# EAGLE board electrosteel2020_2 (EAGLE 9.2.2), part 1 of 3
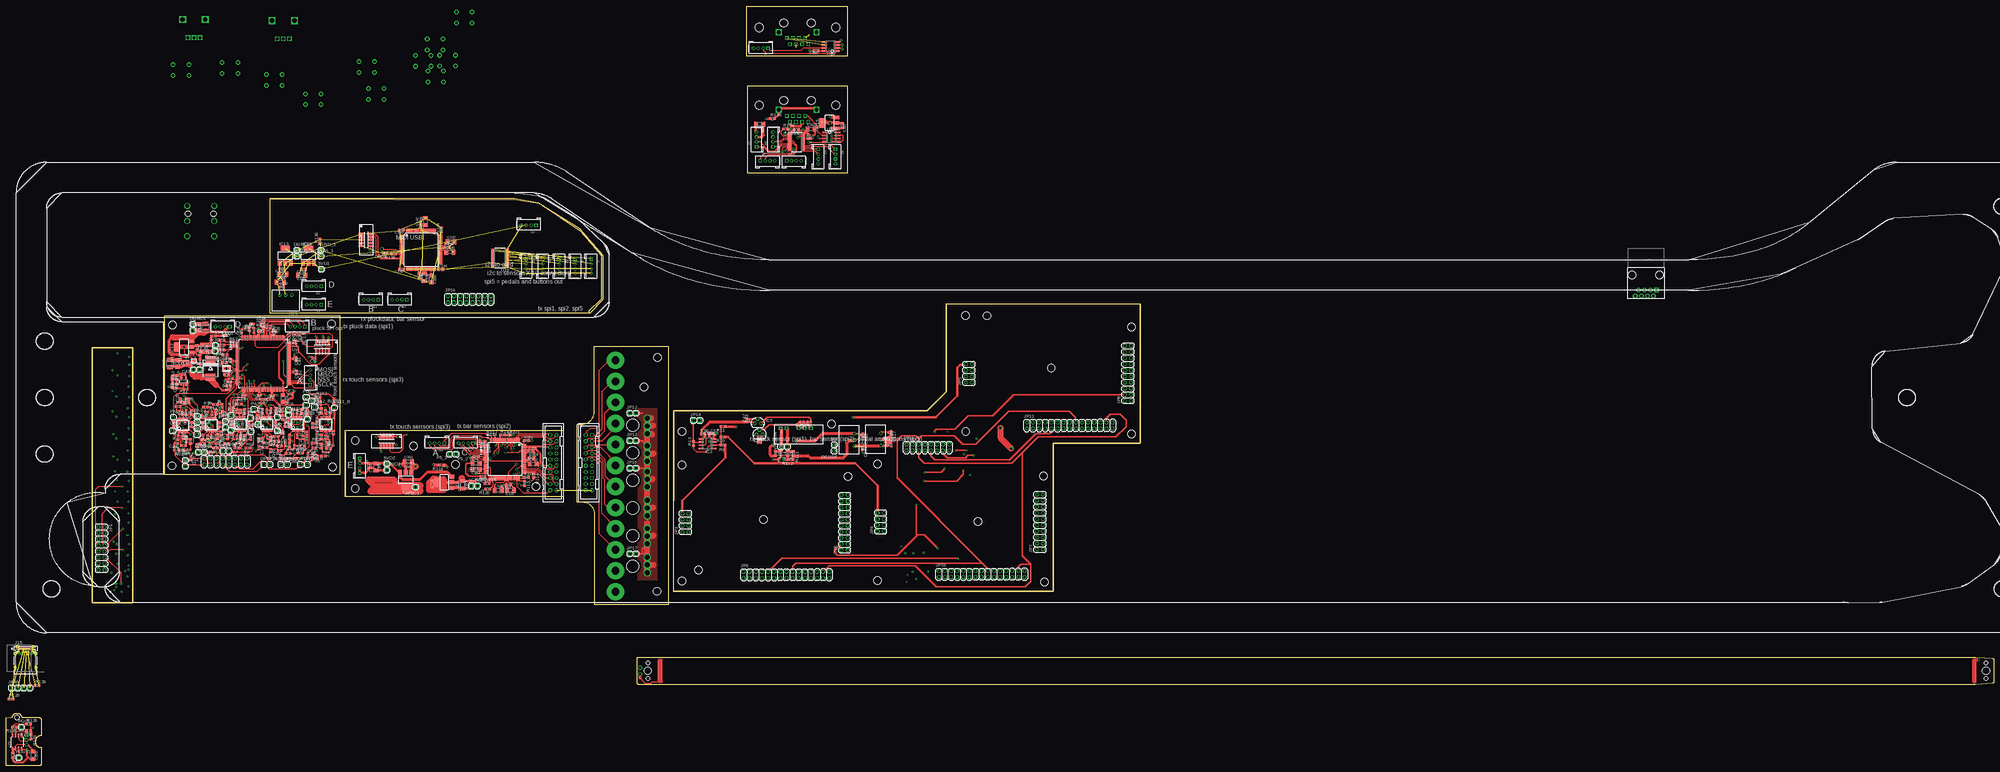
[diagram p7: board, top side]
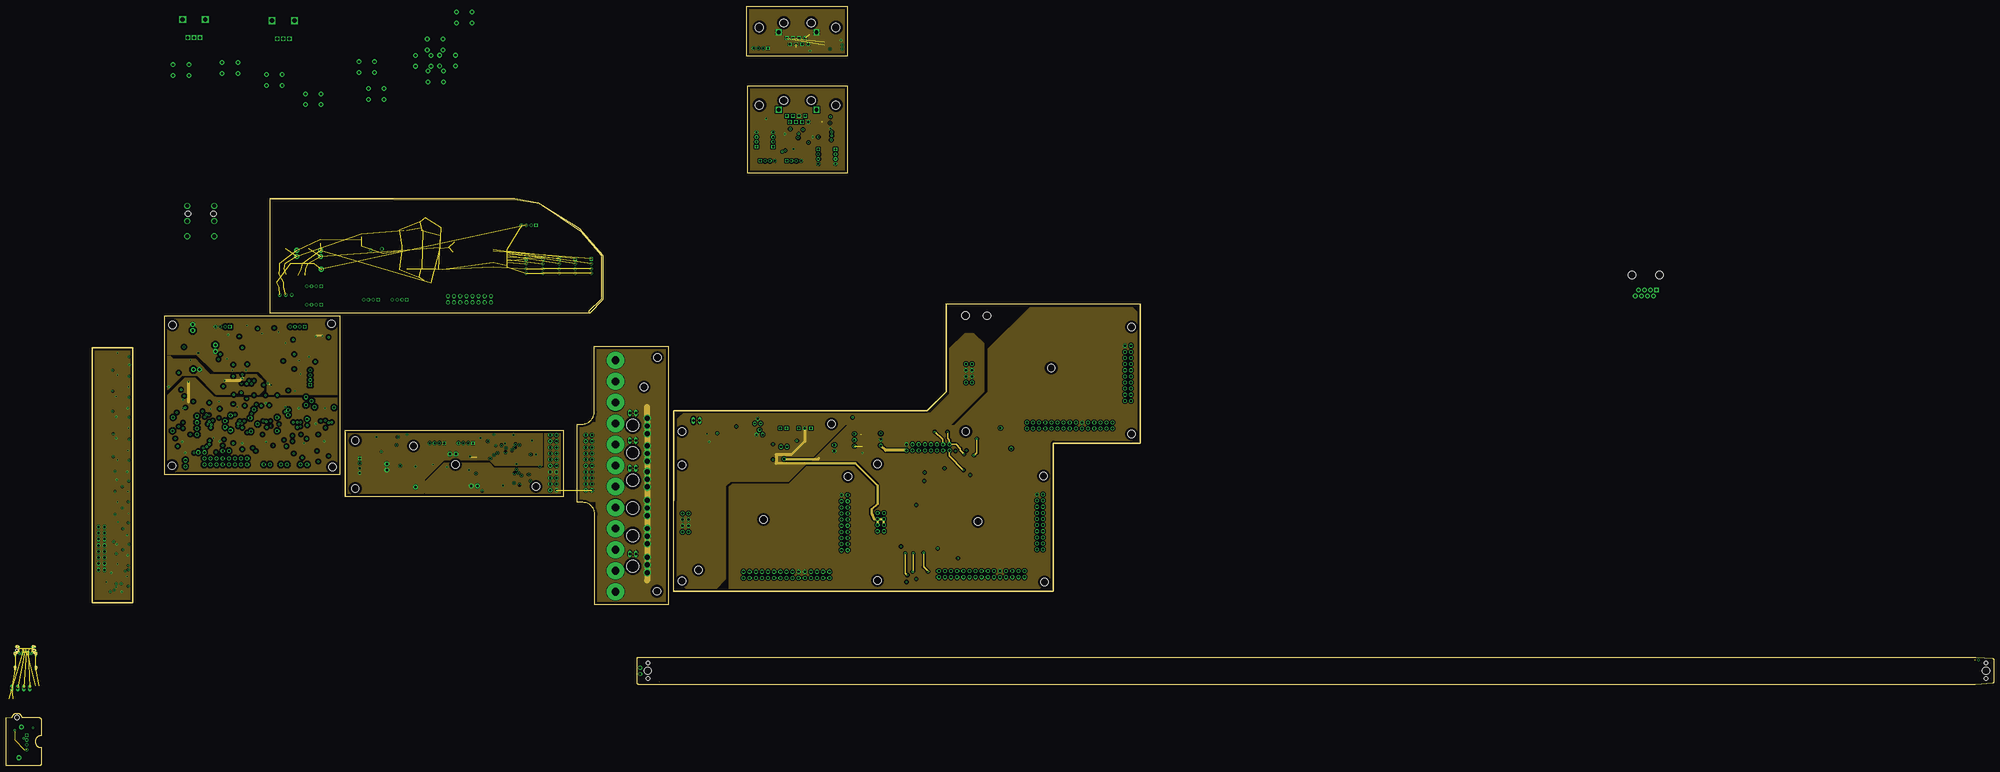
[diagram p8: board, inner layer Route2]
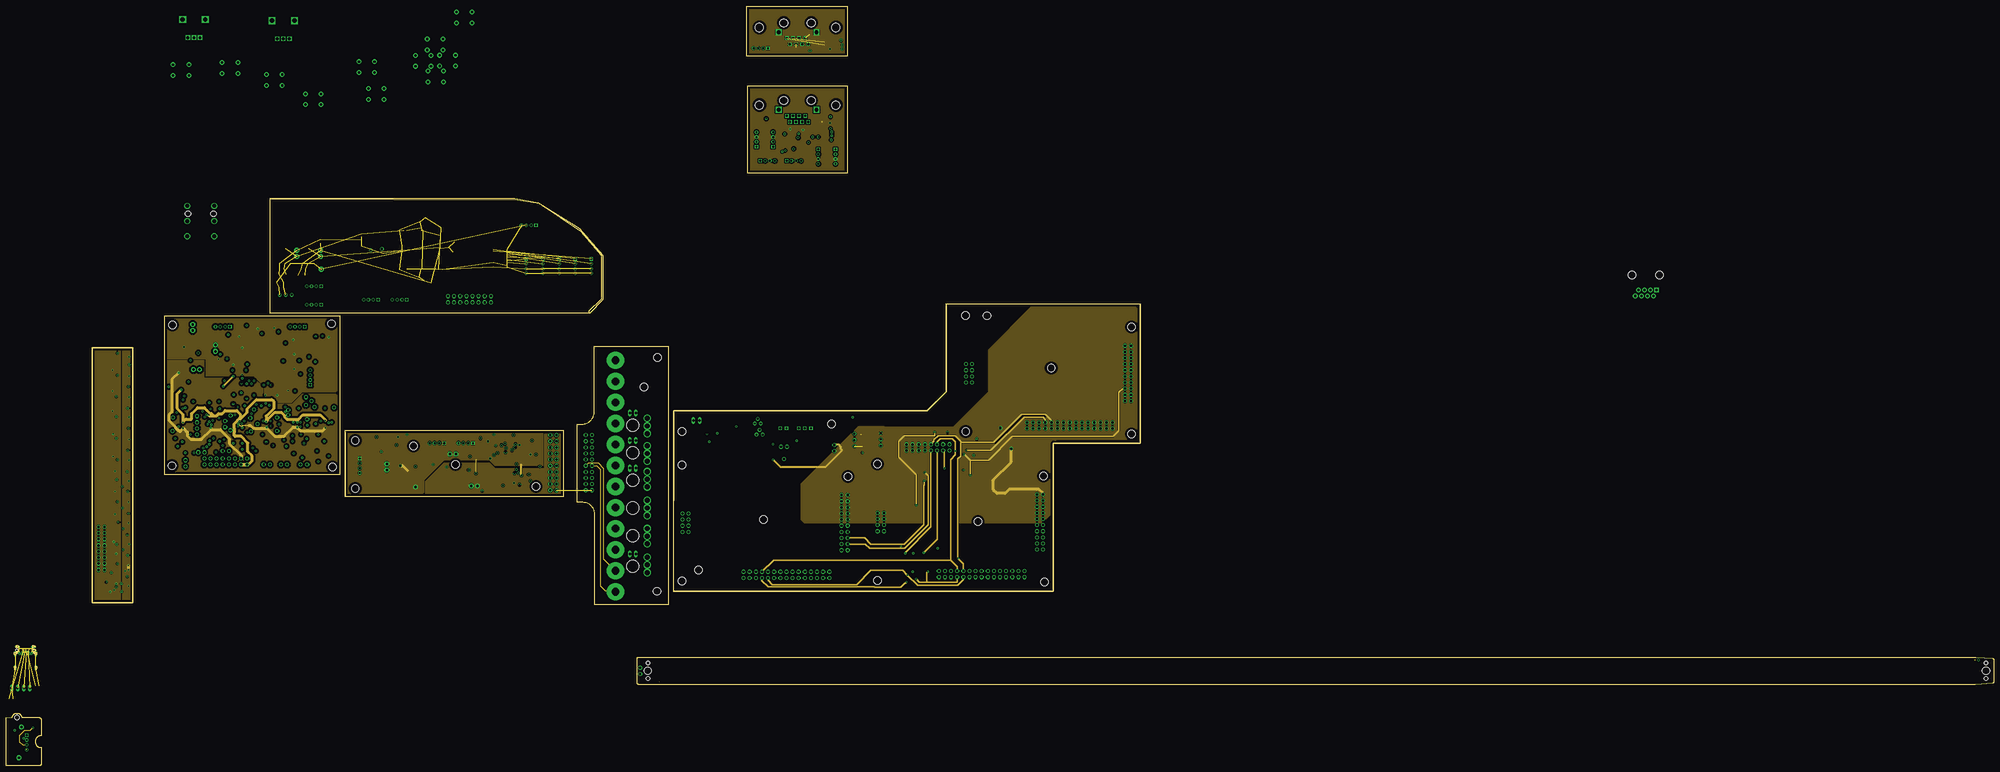
[diagram p9: board, inner layer Route15]
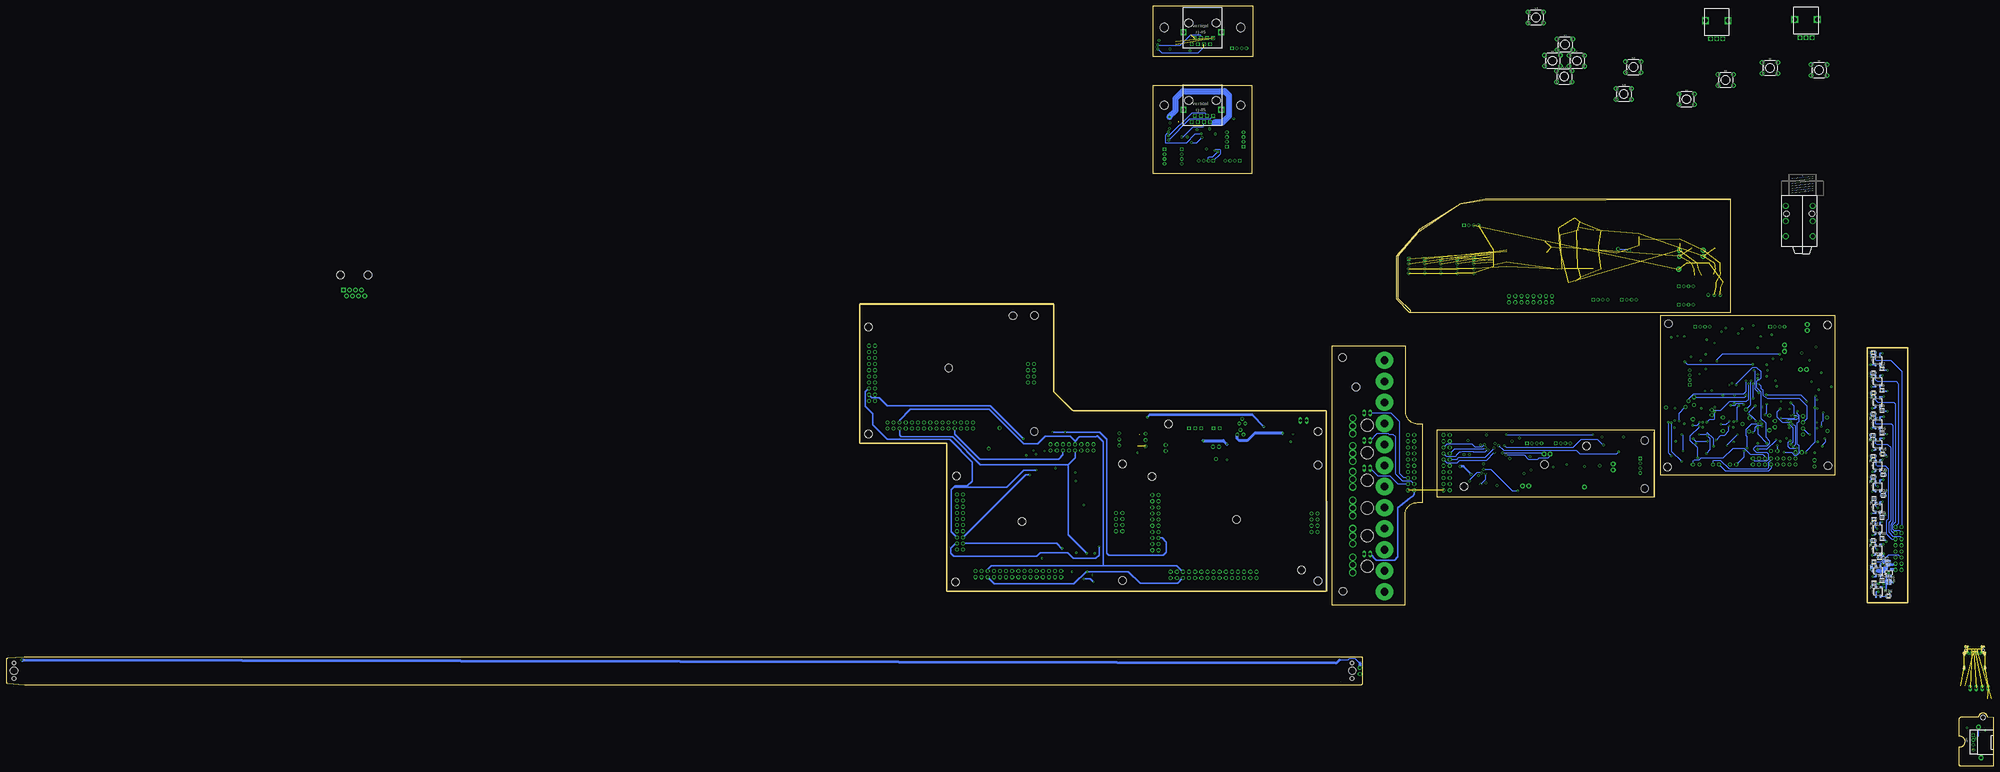
[diagram p10: board, bottom side, seen from below]

Size 824.87 x 315.26 mm. Coordinates in mm from the lower left corner, seen from the top.
Outline: 277.11,147.37 276.86,72.44 434.59,72.44 434.59,133.91 470.66,133.91 470.66,191.57 390.14,191.57 390.14,155.24 382.02,147.37 277.11,147.37
Outline: 109.47,235.25 109.47,188.01 242.32,188.01 247.9,193.6 247.9,211.63 238,222.81 220.98,233.48 211.07,235.25 109.47,235.25
Outline: 35.81,173.53 52.58,173.53 52.58,67.61 35.81,67.61 35.81,173.53
Outline: 244.09,174.04 274.83,174.04 274.83,66.85 244.35,66.85 244.35,104.19 arc90 239.27,109.27 236.98,109.27 236.98,141.78 239.01,141.78 arc90 244.09,146.86 244.09,174.04
Outline: 231.14,139.24 231.14,111.56 140.72,111.56 140.72,139.24 231.14,139.24
Outline: 824.28,34.29 817.14,33.71 arc-5 817.09,33.71 262.51,33.71 arc-90 261.87,34.34 261.87,44.5 arc-90 262.51,45.14 817.22,45.14 arc-5 817.27,45.13 824.28,44.55 arc-85 824.87,43.92 824.87,34.93 arc-85 824.28,34.29
Outline: 65.79,186.74 138.43,186.74 138.43,120.7 65.79,120.7 65.79,186.74
Outline: 2.64,20.07 arc-90 4.45,21.84 4.67,21.84 arc-90 6.48,20.07 13.69,20.07 arc-90 14.58,19.2 14.58,12.57 arc-90 14.45,12.45 arc95 12.17,9.93 arc90 14.48,7.62 arc-90 14.58,7.52 14.58,0.79 arc-90 13.79,0 0,0 0.03,20.04 2.64,20.07
Outline: 307.85,282.24 349,282.24 349,245.92 307.85,245.92 307.85,282.24
Outline: 307.34,315.26 349,315.26 349,294.44 307.34,294.44 307.34,315.26
Copper layers (1+2*15+16): Top 0.035mm / dielectric 0.5mm / Route2 0.035mm / dielectric 0.5mm / Route15 0.035mm / dielectric 0.5mm / Bottom 0.035mm
Design rules "default *": minimum track width 6mil, minimum drill 0.35mm, track to track 9mil, track to pad 9mil, pad to pad 9mil, via to via 9mil, smd to smd 9mil, copper to edge 40mil, drill to drill 6mil, minimum pad ring 10mil, minimum via ring 8mil, stop-mask expansion 4mil, vias tented up to drill 0mil, thermal gap 10mil
Holes 3.17 mm at 280.54,124.89 349.38,120.07 280.54,76.76 361.57,125.15 430.4,120.32 361.62,76.99 398.15,186.89 466.95,182.07 398.22,138.71 270.13,72.44 144.91,134.92 264.8,157.28 68.83,124.51 69.09,182.93 135.13,183.44 135.38,124 314.32,102.16 403.23,101.4 433.71,165.15 342.52,141.78 280.54,138.73 466.98,137.72 407.04,186.74 287.4,81.33 430.91,76.25 270.38,169.47 186.56,125.02 219.84,115.87 169.04,132.64 144.91,115.11
Holes 3.05 mm at 266.32,39.42 821.56,39.42
Holes 1.52 mm at 266.32,36.25 266.32,42.6 821.56,36.25 821.56,42.6
Holes 5.08 mm at 260.1,141.27 260.1,129.84 260.1,118.41 260.1,106.98 260.1,95.55 260.1,82.85
Holes 2.03 mm at 4.55,20.02
Holes 3.56 mm at 312.55,274.12 344.3,274.12 312.55,306.37 344.3,306.37
Milling: 41 lines

## Footprints (pad centres in the part's own frame; a part is rotated, then mirrored left to right if it is on the bottom)
1X01 = drill 1.016 pad 1.93 octagon: 1 0,0
1X01' = drill 1.016 octagon: 1 0,0
C0402 = smd 0.7 x 0.9: 1 -0.65,0; 2 0.65,0
C0201 = smd 0.25 x 0.35: 1 -0.25,0; 2 0.25,0
C0603 = smd 1.1 x 1: 1 -0.85,0; 2 0.85,0
C1206 = smd 1.6 x 1.8: 1 -1.4,0; 2 1.4,0
SMC_B = smd 1.6 x 2.4: + -1.5,0; - 1.5,0
C0603K = smd 1.05 x 1.08: 1 -0.875,0; 2 0.875,0
C1206K = smd 1.5 x 2: 1 -1.5,0; 2 1.5,0
SMC = smd 2.8 x 3.8: A 3.7,0; C -3.7,0
TSSOP14 = smd 0.305 x 0.991: 1 -1.905,-2.718; 2 -1.27,-2.718; 3 -0.635,-2.718; 4 0,-2.718; 5 0.635,-2.718; 6 1.27,-2.718; 7 1.905,-2.718; 8 1.905,2.718; 9 1.27,2.718; 10 0.635,2.718; 11 0,2.718; 12 -0.635,2.718; 13 -1.27,2.718; 14 -1.905,2.718
SO08 = smd 0.6 x 2.2: 1 -1.905,-2.6; 2 -0.635,-2.6; 3 0.635,-2.6; 4 1.905,-2.6; 5 1.905,2.6; 6 0.635,2.6; 7 -0.635,2.6; 8 -1.905,2.6
QFP50P2200X2200X160-144N = smd 1.56 x 0.28: 1 -10.68,8.75; 2 -10.68,8.25; 3 -10.68,7.75; 4 -10.68,7.25; 5 -10.68,6.75; 6 -10.68,6.25; 7 -10.68,5.75; 8 -10.68,5.25; 9 -10.68,4.75; 10 -10.68,4.25; 11 -10.68,3.75; 12 -10.68,3.25; 13 -10.68,2.75; 14 -10.68,2.25; 15 -10.68,1.75; 16 -10.68,1.25; 17 -10.68,0.75; 18 -10.68,0.25; 19 -10.68,-0.25; 20 -10.68,-0.75; 21 -10.68,-1.25; 22 -10.68,-1.75; 23 -10.68,-2.25; 24 -10.68,-2.75; 25 -10.68,-3.25; 26 -10.68,-3.75; 27 -10.68,-4.25; 28 -10.68,-4.75; 29 -10.68,-5.25; 30 -10.68,-5.75; 31 -10.68,-6.25; 32 -10.68,-6.75; 33 -10.68,-7.25; 34 -10.68,-7.75; 35 -10.68,-8.25; 36 -10.68,-8.75; 73 10.68,-8.75; 74 10.68,-8.25; 75 10.68,-7.75; 76 10.68,-7.25; 77 10.68,-6.75; 78 10.68,-6.25; 79 10.68,-5.75; 80 10.68,-5.25; 81 10.68,-4.75; 82 10.68,-4.25; 83 10.68,-3.75; 84 10.68,-3.25; 85 10.68,-2.75; 86 10.68,-2.25; 87 10.68,-1.75; 88 10.68,-1.25; 89 10.68,-0.75; 90 10.68,-0.25; 91 10.68,0.25; 92 10.68,0.75; 93 10.68,1.25; 94 10.68,1.75; 95 10.68,2.25; 96 10.68,2.75; 97 10.68,3.25; 98 10.68,3.75; 99 10.68,4.25; 100 10.68,4.75; 101 10.68,5.25; 102 10.68,5.75; 103 10.68,6.25; 104 10.68,6.75; 105 10.68,7.25; 106 10.68,7.75; 107 10.68,8.25; 108 10.68,8.75 | smd 0.28 x 1.56: 37 -8.75,-10.68; 38 -8.25,-10.68; 39 -7.75,-10.68; 40 -7.25,-10.68; 41 -6.75,-10.68; 42 -6.25,-10.68; 43 -5.75,-10.68; 44 -5.25,-10.68; 45 -4.75,-10.68; 46 -4.25,-10.68; 47 -3.75,-10.68; 48 -3.25,-10.68; 49 -2.75,-10.68; 50 -2.25,-10.68; 51 -1.75,-10.68; 52 -1.25,-10.68; 53 -0.75,-10.68; 54 -0.25,-10.68; 55 0.25,-10.68; 56 0.75,-10.68; 57 1.25,-10.68; 58 1.75,-10.68; 59 2.25,-10.68; 60 2.75,-10.68; 61 3.25,-10.68; 62 3.75,-10.68; 63 4.25,-10.68; 64 4.75,-10.68; 65 5.25,-10.68; 66 5.75,-10.68; 67 6.25,-10.68; 68 6.75,-10.68; 69 7.25,-10.68; 70 7.75,-10.68; 71 8.25,-10.68; 72 8.75,-10.68; 109 8.75,10.68; 110 8.25,10.68; 111 7.75,10.68; 112 7.25,10.68; 113 6.75,10.68; 114 6.25,10.68; 115 5.75,10.68; 116 5.25,10.68; 117 4.75,10.68; 118 4.25,10.68; 119 3.75,10.68; 120 3.25,10.68; 121 2.75,10.68; 122 2.25,10.68; 123 1.75,10.68; 124 1.25,10.68; 125 0.75,10.68; 126 0.25,10.68; 127 -0.25,10.68; 128 -0.75,10.68; 129 -1.25,10.68; 130 -1.75,10.68; 131 -2.25,10.68; 132 -2.75,10.68; 133 -3.25,10.68; 134 -3.75,10.68; 135 -4.25,10.68; 136 -4.75,10.68; 137 -5.25,10.68; 138 -5.75,10.68; 139 -6.25,10.68; 140 -6.75,10.68; 141 -7.25,10.68; 142 -7.75,10.68; 143 -8.25,10.68; 144 -8.75,10.68
SOT23-5 = smd 0.6 x 1.2: 1 -0.95,-1.306; 2 0,-1.306; 3 0.95,-1.306; 4 0.95,1.306; 5 -0.95,1.306
78LXX = drill 0.813 octagon: GND 0,1.905; IN 1.27,0; OUT -1.27,0
79LXX = drill 0.813 octagon: GND -1.27,0; IN 0,1.905; OUT 1.27,0
6-WSON = smd 0.45 x 0.3: 1 -0.975,0.65; 2 -0.975,0; 3 -0.975,-0.65; 4 0.975,-0.65; 5 0.975,0; 6 0.975,0.65 | smd 0.9 x 1.6: PAD 0,0
SOT223 = smd 1.499 x 2.007: 1 -2.261,-3.15; 2 0.025,-3.15; 3 2.311,-3.15 | smd 3.81 x 2.007: PAD 0,3.15
AUDIO_JACK_0.25"_TRS_PTH_RA = drill 1.6: RING 10.5,-6.95; RING-NORM 10.5,4.35; SLEEVE 4.2,-6.95; SLEEVE-NORM 4.2,4.35; TIP 16.8,-6.95; TIP-NORM 16.8,4.35 | hole 2.2: 7.4,4; 7.4,-6.6
HW4-2.0 = drill 0.8 pad 1.27 square: 1 -3,0 | drill 0.8 pad 1.27: 2 -1,0; 3 1,0; 4 3,0
RJ45-8 = drill 1 pad 1.88 square: 1 -4.445,6.35 | drill 1 pad 1.88: 2 -3.175,8.89; 3 -1.905,6.35; 4 -0.635,8.89; 5 0.635,6.35; 6 1.905,8.89; 7 3.175,6.35; 8 4.445,8.89 | hole 3.2: -5.715,0; 5.715,0
CUI_UJ31-CH-312-SMT-TR = smd 0.32 x 0.7: A1 0,0; A2 0.5,0; A3 1,0; A4 1.5,0; A5 2,0; A6 2.5,0; A7 3,0; A8 3.5,0; A9 4,0; A10 4.5,0; A11 5,0; A12 5.5,0 | drill 0.4 pad 0.6: B1 5.55,-1.31; B2 5.15,-2.01; B3 4.35,-2.01; B4 3.95,-1.31; B5 3.55,-2.01; B6 3.15,-1.31; B7 2.35,-1.31; B8 1.95,-2.01; B9 1.55,-1.31; B10 1.15,-2.01; B11 0.35,-2.01; B12 -0.05,-1.31 | drill 0.6 pad 0.7 long: SH1 -0.62,0.89; SH2 6.12,0.89 | drill 0.6 pad 0.8 long: SH3 -1.255,-1.66; SH4 6.755,-1.66 | drill 0.6 pad 0.9 long: SH5 -1.58,-2.16; SH6 7.08,-2.16; SH7 -1.58,-7.86; SH8 7.08,-7.86 | hole 0.85: -0.85,-0.66; 6.35,-0.66
HW4-2.0-90D = drill 0.8 pad 1.27 square: 1 -3,0 | drill 0.8 pad 1.27: 2 -1,0; 3 1,0; 4 3,0
2X08 = drill 1.016 octagon: 1 -8.89,-1.27; 2 -8.89,1.27; 3 -6.35,-1.27; 4 -6.35,1.27; 5 -3.81,-1.27; 6 -3.81,1.27; 7 -1.27,-1.27; 8 -1.27,1.27; 9 1.27,-1.27; 10 1.27,1.27; 11 3.81,-1.27; 12 3.81,1.27; 13 6.35,-1.27; 14 6.35,1.27; 15 8.89,-1.27; 16 8.89,1.27
2X04 = drill 1.016 octagon: 1 -3.81,-1.27; 2 -3.81,1.27; 3 -1.27,-1.27; 4 -1.27,1.27; 5 1.27,-1.27; 6 1.27,1.27; 7 3.81,-1.27; 8 3.81,1.27
2X10 = drill 1.016 octagon: 1 -11.43,-1.27; 2 -11.43,1.27; 3 -8.89,-1.27; 4 -8.89,1.27; 5 -6.35,-1.27; 6 -6.35,1.27; 7 -3.81,-1.27; 8 -3.81,1.27; 9 -1.27,-1.27; 10 -1.27,1.27; 11 1.27,-1.27; 12 1.27,1.27; 13 3.81,-1.27; 14 3.81,1.27; 15 6.35,-1.27; 16 6.35,1.27; 17 8.89,-1.27; 18 8.89,1.27; 19 11.43,-1.27; 20 11.43,1.27
2X15 = drill 1.016 octagon: 1 -17.78,-1.27; 2 -17.78,1.27; 3 -15.24,-1.27; 4 -15.24,1.27; 5 -12.7,-1.27; 6 -12.7,1.27; 7 -10.16,-1.27; 8 -10.16,1.27; 9 -7.62,-1.27; 10 -7.62,1.27; 11 -5.08,-1.27; 12 -5.08,1.27; 13 -2.54,-1.27; 14 -2.54,1.27; 15 0,-1.27; 16 0,1.27; 17 2.54,-1.27; 18 2.54,1.27; 19 5.08,-1.27; 20 5.08,1.27; 21 7.62,-1.27; 22 7.62,1.27; 23 10.16,-1.27; 24 10.16,1.27; 25 12.7,-1.27; 26 12.7,1.27; 27 15.24,-1.27; 28 15.24,1.27; 29 17.78,-1.27; 30 17.78,1.27
1X02 = drill 1.016 long: 1 -1.27,0; 2 1.27,0
1X04 = drill 1.016 long: 1 -3.81,0; 2 -1.27,0; 3 1.27,0; 4 3.81,0
CHIP-LED0603 = smd 0.8 x 0.8: A 0,-0.75; C 0,0.75
NX3225 = smd 1.4 x 1.2: 1 -1.1,-0.8; 2 1.1,-0.8; 3 1.1,0.8; 4 -1.1,0.8
RESC1608X60 = smd 0.799 x 0.974: 1 -0.815,0; 2 0.815,0
R0603 = smd 1 x 1.1: 1 -0.85,0; 2 0.85,0
R0402 = smd 0.7 x 0.9: 1 -0.55,0; 2 0.55,0
R0201 = smd 0.28 x 0.43: 1 -0.255,0; 2 0.255,0
TACTILE_SWITCH_PTH_6.0MM = drill 1.016 pad 1.88: 1 -3.251,2.261; 2 3.251,2.261; 3 -3.251,-2.261; 4 3.251,-2.261
TQFP-100-14X14MM = smd 1.5 x 0.27: 1 -8,6; 2 -8,5.5; 3 -8,5; 4 -8,4.5; 5 -8,4; 6 -8,3.5; 7 -8,3; 8 -8,2.5; 9 -8,2; 10 -8,1.5; 11 -8,1; 12 -8,0.5; 13 -8,0; 14 -8,-0.5; 15 -8,-1; 16 -8,-1.5; 17 -8,-2; 18 -8,-2.5; 19 -8,-3; 20 -8,-3.5; 21 -8,-4; 22 -8,-4.5; 23 -8,-5; 24 -8,-5.5; 25 -8,-6; 51 8,-6; 52 8,-5.5; 53 8,-5; 54 8,-4.5; 55 8,-4; 56 8,-3.5; 57 8,-3; 58 8,-2.5; 59 8,-2; 60 8,-1.5; 61 8,-1; 62 8,-0.5; 63 8,0; 64 8,0.5; 65 8,1; 66 8,1.5; 67 8,2; 68 8,2.5; 69 8,3; 70 8,3.5; 71 8,4; 72 8,4.5; 73 8,5; 74 8,5.5; 75 8,6 | smd 0.27 x 1.5: 26 -6,-8; 27 -5.5,-8; 28 -5,-8; 29 -4.5,-8; 30 -4,-8; 31 -3.5,-8; 32 -3,-8; 33 -2.5,-8; 34 -2,-8; 35 -1.5,-8; 36 -1,-8; 37 -0.5,-8; 38 0,-8; 39 0.5,-8; 40 1,-8; 41 1.5,-8; 42 2,-8; 43 2.5,-8; 44 3,-8; 45 3.5,-8; 46 4,-8; 47 4.5,-8; 48 5,-8; 49 5.5,-8; 50 6,-8; 76 6,8; 77 5.5,8; 78 5,8; 79 4.5,8; 80 4,8; 81 3.5,8; 82 3,8; 83 2.5,8; 84 2,8; 85 1.5,8; 86 1,8; 87 0.5,8; 88 0,8; 89 -0.5,8; 90 -1,8; 91 -1.5,8; 92 -2,8; 93 -2.5,8; 94 -3,8; 95 -3.5,8; 96 -4,8; 97 -4.5,8; 98 -5,8; 99 -5.5,8; 100 -6,8
QRE1113 = smd 1.2 x 0.6: 1 -1.8,-0.9; 2 1.8,-0.9; 3 1.8,0.9; 4 -1.8,0.9
DC-DC_CONVERTER_78XX = drill 0.8: GND 0,0; VIN -2.54,0; VOUT 2.54,0
TEXAS_SOT23-5 = smd 0.55 x 1.2: 1 -0.95,-1.3; 2 0,-1.3; 3 0.95,-1.3; 4 0.95,1.3; 5 -0.95,1.3
SOP65P640X120-24N = smd 1.57 x 0.41: 1 -2.87,3.575; 2 -2.87,2.925; 3 -2.87,2.275; 4 -2.87,1.625; 5 -2.87,0.975; 6 -2.87,0.325; 7 -2.87,-0.325; 8 -2.87,-0.975; 9 -2.87,-1.625; 10 -2.87,-2.275; 11 -2.87,-2.925; 12 -2.87,-3.575; 13 2.87,-3.575; 14 2.87,-2.925; 15 2.87,-2.275; 16 2.87,-1.625; 17 2.87,-0.975; 18 2.87,-0.325; 19 2.87,0.325; 20 2.87,0.975; 21 2.87,1.625; 22 2.87,2.275; 23 2.87,2.925; 24 2.87,3.575
SOIC8-1.27-5X4MM = smd 0.6 x 1.4: 1 -1.905,-2.7; 2 -0.635,-2.7; 3 0.635,-2.7; 4 1.905,-2.7; 5 1.905,2.7; 6 0.635,2.7; 7 -0.635,2.7; 8 -1.905,2.7
RK09 = drill 1.2 square: 1-09 -2.5,-7.5; 2-09 0,-7.5; 3-09 2.5,-7.5 | drill 1.854 square: MOUNT1 -4.683,0; MOUNT2 4.683,0
CMR0512S3C = drill 0.8 square: P$1 -7.62,0; P$2 -5.08,0; P$3 0,0; P$4 2.54,0; P$5 5.08,0
SS-7188VS-A-FLS_RJ45 = drill 0.889 square: P$1 -4.445,4.445; P$2 -3.175,6.985; P$3 -1.905,4.445; P$4 -0.635,6.985; P$5 0.635,4.445; P$6 1.905,6.985; P$7 3.175,4.445; P$8 4.445,6.985 | drill 1.651 square: P$9 -7.874,1.981; P$10 7.874,1.981 | hole 3.277: -5.715,-1.905; 5.715,-1.905
SO8 = smd 0.6 x 2.2: 1 -1.905,-2.6; 2 -0.635,-2.6; 3 0.635,-2.6; 4 1.905,-2.6; 5 1.905,2.6; 6 0.635,2.6; 7 -0.635,2.6; 8 -1.905,2.6
3221-10-0300-00 = smd 0.76 x 2.4: 1 -2.54,-1.87; 2 -2.54,1.97; 3 -1.27,-1.87; 4 -1.27,1.97; 5 0,-1.87; 6 0,1.97; 7 1.27,-1.87; 8 1.27,1.97; 9 2.54,-1.87; 10 2.54,1.97
PAK100/2500-20 = drill 1 pad 1.422: 1 -11.43,-1.27; 2 -11.43,1.27; 3 -8.89,-1.27; 4 -8.89,1.27; 5 -6.35,-1.27; 6 -6.35,1.27; 7 -3.81,-1.27; 8 -3.81,1.27; 9 -1.27,-1.27; 10 -1.27,1.27; 11 1.27,-1.27; 12 1.27,1.27; 13 3.81,-1.27; 14 3.81,1.27; 15 6.35,-1.27; 16 6.35,1.27; 17 8.89,-1.27; 18 8.89,1.27; 19 11.43,-1.27; 20 11.43,1.27

## Placement (x,y rotation side)
3V3A  [1X01]  77.72,164.39 0 top
3V3A_1  [1X01]  130.56,211.38 0 top
3V3A_2  [1X01]  195.58,116.13 0 top
3V3D  [1X01]  86.87,174.55 0 top
3V3D1  [1X01]  120.65,211.38 0 top
3V3D2  [1X01]  169.93,115.62 180 top
5V  [1X01]  77.47,180.64 0 top
5V/1  PINHD-1X1  [1X01']  343.66,133.15 0 top
5VD1  [1X01]  130.81,206.04 0 top
5VD2  [1X01]  157.99,125.27 0 top
AGND  [1X01]  80.26,164.39 0 top
AGND_1  [1X01]  130.56,213.92 0 top
AGND_2  [1X01]  193.04,116.13 0 top
C1  .1uf  [C0402]  105.16,153.72 180 top
C2  .1uf  [C0402]  93.22,168.2 90 top
C3  .1uf  [C0402]  117.86,154.23 0 top
C4  .1uf  [C0402]  97.79,180.39 90 top
C5  .1uf  [C0402]  127.76,169.21 180 top
C6  .01uf  [C0201]  110.19,154.61 180 top
C7  .01uf  [C0201]  118.87,175.31 270 top
C8  .01uf  [C0201]  105.16,154.74 180 top
C9  .01uf  [C0201]  94.23,167.94 90 top
C10  .01uf  [C0201]  98.68,154.76 180 top
C11  .1uf  [C0402]  120.4,168.96 270 top
C12  .1uf  [C0402]  120.65,163.37 270 top
C13  .1uf  [C0402]  110.49,153.47 180 top
C14  .1uf  [C0402]  98.81,153.72 180 top
C15  .1uf  [C0402]  43.69,75.49 0 bottom
C16  .01uf  [C0402]  43.69,77.01 0 bottom
C17  18pf  [C0603]  90.68,167.44 180 top
C18  18pf  [C0603]  91.44,162.36 0 top
C19  2.2uf  [C1206]  114.81,152.45 270 top
C20  .1uf  [C0402]  111.25,180.14 0 top
C21  .01uf  [C0402]  43.18,84.38 90 bottom
C22  .1uf  [C0402]  44.45,84.38 90 bottom
C23  .1uf  [C0402]  69.85,131.62 270 top
C24  .1uf  [C0402]  70.61,133.91 180 top
C25  .1uf  [C0402]  74.68,136.19 90 top
C26  .1uf  [C0402]  75.95,131.11 180 top
C27  .1uf  [C0402]  76.71,127.56 270 top
C28  .1uf  [C0402]  75.18,152.2 180 top
C29  .1uf  [C0402]  72.39,151.69 90 top
C30  .1uf  [C0402]  71.88,146.61 270 top
C31  .1uf  [C0402]  68.83,161.09 270 top
C32  .1uf  [C0402]  68.83,157.78 270 top
C33  .1uf  [C0402]  79.25,132.89 270 top
C34  .1uf  [C0402]  83.57,136.45 270 top
C35  .1uf  [C0402]  87.88,133.65 0 top
C36  .1uf  [C0402]  89.41,137.97 90 top
C37  .1uf  [C0402]  85.09,130.1 180 top
C38  .1uf  [C0402]  83.31,146.86 180 top
C39  .1uf  [C0402]  89.66,149.4 90 top
C40  .1uf  [C0402]  81.28,144.83 270 top
C41  .1uf  [C0402]  85.09,136.7 270 top
C42  .1uf  [C0402]  85.34,146.35 270 top
C43  .1uf  [C0402]  73.66,162.36 0 top
C44  .1uf  [C0402]  74.68,156.26 180 top
C45  .1uf  [C0402]  73.41,136.19 270 top
C46  .1uf  [C0402]  73.15,146.35 270 top
C47  .1uf  [C0402]  307.59,143.31 90 top
C48  .1uf  [C0402]  312.67,134.16 0 top
C49  .1uf  [C0402]  330.2,142.8 180 top
C50  .1uf  [C0402]  333.25,142.8 180 top
C51  .01uf  [C0201]  308.61,143.31 90 top
C52  .01uf  [C0201]  312.67,135.18 0 top
C53  .01uf  [C0201]  332.74,141.78 180 top
C54  .01uf  [C0201]  330.45,141.78 180 top
C55  .1uf  [C0402]  105.41,180.39 0 top
C56  .1uf  [C0402]  289.05,137.72 0 top
C57  .1uf  [C0402]  292.86,137.72 0 top
C58  .01uf  [C0201]  290.07,136.7 0 top
C59  .01uf  [C0201]  291.85,136.7 0 top
C60  .1uf  [C0402]  91.44,133.91 180 top
C61  .1uf  [C0402]  95.76,136.45 270 top
C62  .1uf  [C0402]  96.27,133.91 0 top
C63  .1uf  [C0402]  120.4,175.82 270 top
C64  .01uf  [C0402]  93.22,160.58 180 top
C65  .01uf  [C0402]  92.68,159.31 180 top
C66  .01uf  [C0201]  119.13,168.96 270 top
C67  .01uf  [C0201]  119.15,163.45 270 top
C68  .01uf  [C0201]  109.73,179.12 0 top
C69  .01uf  [C0201]  104.67,179.12 0 top
C70  .1uf  [C0402]  101.6,135.94 90 top
C71  .1uf  [C0402]  95.25,130.35 180 top
C72  .1uf  [C0402]  99.82,130.35 180 top
C73  .1uf  [C0402]  96.01,147.12 90 top
C74  .1uf  [C0402]  95,151.69 180 top
C75  .1uf  [C0402]  104.9,131.88 270 top
C76  .1uf  [C0402]  104.65,135.18 270 top
C77  .1uf  [C0402]  109.73,135.69 270 top
C78  .1uf  [C0402]  114.3,138.48 90 top
C79  .1uf  [C0402]  109.73,130.86 270 top
C80  .1uf  [C0402]  113.54,130.86 180 top
C81  .1uf  [C0402]  106.17,150.42 0 top
C82  .1uf  [C0402]  104.65,147.88 270 top
C83  .1uf  [C0402]  113.79,128.32 270 top
C84  .1uf  [C0402]  119.63,132.38 270 top
C85  .1uf  [C0402]  123.44,136.19 270 top
C86  .1uf  [C0402]  124.71,137.97 90 top
C87  .1uf  [C0402]  117.09,127.56 180 top
C88  .1uf  [C0402]  120.14,127.56 180 top
C89  .1uf  [C0402]  114.81,147.62 90 top
C90  .1uf  [C0402]  116.59,142.54 0 top
C91  .1uf  [C0402]  125.22,129.08 270 top
C92  .1uf  [C0402]  127.76,131.88 180 top
C93  .1uf  [C0402]  133.6,134.16 180 top
C94  .1uf  [C0402]  135.89,138.23 90 top
C95  .1uf  [C0402]  127.25,128.83 270 top
C96  .1uf  [C0402]  129.29,128.07 90 top
C97  .1uf  [C0402]  129.03,143.56 270 top
C98  .1uf  [C0402]  130.56,150.42 90 top
C99  .1uf  [C0402]  97.28,136.45 270 top
C100  .1uf  [C0402]  97.28,147.12 270 top
C101  .1uf  [C0402]  108.46,136.45 270 top
C102  .1uf  [C0402]  108.2,147.12 270 top
C103  .1uf  [C0402]  120.9,136.7 270 top
C104  .1uf  [C0402]  120.9,146.86 270 top
C105  .1uf  [C0402]  132.59,136.45 270 top
C106  .1uf  [C0402]  132.59,146.86 270 top
C107  .1uf  [C0603]  79.25,173.53 270 top
C108  1uf  [C1206]  81.53,173.28 270 top
C109  10uf  [SMC_B]  84.07,173.28 270 top
C110  .1uf  [C0603]  73.41,166.93 90 top
C111  1uf  [C1206]  71.12,166.93 90 top
C112  10uf  [SMC_B]  68.07,166.93 90 top
C113  .1uf  [C0402]  75.44,167.18 90 top
C114  1uf  [C1206]  80.01,181.91 90 top
C115  10uf  [SMC_B]  82.8,181.91 90 top
C116  .01uf  [C0201]  76.45,167.18 90 top
C117  .1uf  [C0402]  367.28,138.23 270 top
C118  .1uf  [C0402]  367.28,133.15 90 top
C119  .01uf  [C0201]  366.01,138.23 270 top
C120  .01uf  [C0201]  366.04,133.2 90 top
C121  .01uf  [C0201]  354.58,137.21 270 top
C122  .1uf  [C0402]  355.6,137.21 270 top
C123  .1uf  [C0402]  355.35,131.88 270 top
C124  .1uf  [C0603K]  208.53,116.64 180 top
C125  1uf  [C1206K]  209.3,114.35 180 top
C126  1uf  [C1206K]  204.22,114.35 0 top
C127  .1uf  [C0603K]  114.3,198.68 0 top
C128  .1uf  [C0603K]  114.55,206.3 180 top
C129  10uf  [C1206K]  113.79,200.71 0 top
C130  10uf  [C1206K]  114.81,204.01 180 top
C131  1uf  [C1206K]  195.07,125.53 180 top
C132  1uf  [C1206K]  218.69,125.27 0 top
C133  .1uf  [C0603K]  215.9,119.68 0 top
C134  .1uf  [C0603K]  123.44,206.04 180 top
C135  10uf  [C1206K]  122.68,203.5 180 top
C136  .1uf  [C0603K]  182.88,215.19 0 top
C137  1uf  [C1206K]  184.66,217.47 0 top
C138  1uf  [C1206K]  184.15,213.16 0 top
C139  1uf  [C1206K]  173.99,225.86 90 top
C140  1uf  [C1206K]  173.48,202.74 270 top
C141  .1uf  [C0603K]  180.34,206.04 0 top
C142  .1uf  [C0603K]  171.96,224.84 90 top
C143  .1uf  [C0603K]  164.08,222.3 180 top
C144  .1uf  [C0603K]  180.59,222.3 90 top
C145  .1uf  [C0603K]  164.08,206.04 180 top
C146  .1uf  [C0603K]  171.45,203.5 270 top
C147  .1uf  [C0603K]  2.79,4.37 270 top
C148  .1uf  [C0603K]  197.61,134.67 180 top
C149  .1uf  [C0603K]  197.87,119.94 180 top
C150  .1uf  [C0603K]  215.9,134.92 0 top
C151  .1uf  [C0603K]  195.07,128.32 180 top
C152  .1uf  [C0603K]  187.2,116.64 270 top
C153  10uf  [C1206K]  189.48,116.64 270 top
C154  .1uf  [C0603K]  217.91,127.76 0 top
C155  2200pf  [C0603K]  217.68,130.35 0 top
C156  .1uf  [C0603K]  150.37,124.51 270 top
C157  .1uf  [C0603K]  166.88,124 0 top
C158  1uf  [C1206K]  176.53,201.98 270 top
C159  1uf  [C1206K]  11.18,4.37 270 top
C160  10uf  [C1206K]  153.42,124 270 top
C161  10uf  [C1206K]  166.88,126.29 0 top
C162  1uf  [C1206K]  334.01,264.21 0 top
C163  1uf  [C1206K]  195.07,122.99 180 top
C164  .1uf  [C0603K]  332.74,261.16 270 top
C166  .1uf  [C0603K]  336.04,296.72 180 top
C167  .1uf  [C0603K]  346.96,265.73 270 top
C168  10uf  [C1206K]  312.67,266.24 180 top
D3  MBRS340T3  [SMC]  84.84,164.9 270 top
DGND  [1X01]  86.87,172.01 180 top
DGND1  [1X01]  77.47,183.18 0 top
DGND2  [1X01]  120.65,213.92 0 top
DGND3  [1X01]  157.99,122.73 0 top
DGND5  PINHD-1X1  [1X01']  343.66,130.61 180 top
HOUT1  [1X01]  5.33,3.35 0 top
IC1  OPA4344E  [TSSOP14]  85.09,141.53 0 top
IC2  OPA134D  [SO08]  291.08,133.65 90 top
IC3  STM32H743ZIT6  [QFP50P2200X2200X160-144N]  106.68,166.93 0 top
IC4  LMV321M5  [SOT23-5]  73.66,159.56 0 top
IC5  [78LXX]  311.91,142.04 0 top
IC6  [79LXX]  312.67,137.46 0 top
IC7  OPA4344E  [TSSOP14]  97.28,141.78 0 top
IC8  OPA4344E  [TSSOP14]  108.2,141.78 0 top
IC9  OPA4344E  [TSSOP14]  120.9,141.78 0 top
IC10  OPA4344E  [TSSOP14]  132.59,141.78 0 top
IC11  LP5912  [6-WSON]  77.98,167.94 90 top
IC12  REG1117  [SOT223]  73.91,173.79 90 top
IC13  REG1117  [SOT223]  115.82,211.63 0 top
IC14  REG1117  [SOT223]  125.48,211.63 0 top
IC15  REG1117  [SOT223]  341.63,266.75 90 top
IC17  OPA4344E  [TSSOP14]  73.41,141.27 0 top
IC18  REG1117  [SOT223]  181.86,117.65 90 top
IC20  REG1117  [SOT223]  165.86,118.67 180 top
J1  AUDIO_JACK_TRS_0.25"_PTH_RA  [AUDIO_JACK_0.25"_TRS_PTH_RA]  79.5,236.52 270 bottom
J2  4P-2.0  [HW4-2.0]  313.18,297.74 180 top
J3  4P-2.0  [HW4-2.0]  215.9,207.31 270 top
J4  4P-2.0  [HW4-2.0]  222.76,207.31 270 top
J5  4P-2.0  [HW4-2.0]  229.62,207.31 270 top
J6  4P-2.0  [HW4-2.0]  236.22,207.31 270 top
J7  4P-2.0  [HW4-2.0]  242.82,207.31 270 top
J8  4P-2.0  [HW4-2.0]  120.9,182.17 180 top
J9  RJ45  [RJ45-8]  680.47,203.76 180 top
J10  4P-2.0  [HW4-2.0]  126.24,161.09 90 top
J11  4P-2.0  [HW4-2.0]  178.82,133.91 180 top
J12  4P-2.0  [HW4-2.0]  190.75,133.91 180 top
J13  4P-2.0  [HW4-2.0]  151.38,193.34 180 top
J14  4P-2.0  [HW4-2.0]  163.32,193.34 180 top
J15  UJ31-CH-312-SMT-TR  [CUI_UJ31-CH-312-SMT-TR]  5.33,48.56 0 top
J16  4P-2.0  [HW4-2.0]  146.81,124.51 270 top
J17  4P-2.0  [HW4-2.0]  89.92,182.17 180 top
J18  4P-2.0  [HW4-2.0]  127.76,191.31 180 top
J19  4P-2.0  [HW4-2.0]  127.76,198.93 180 top
J20  4P-2.0  [HW4-2.0]  318.26,259.89 90 top
J21  4P-2.0  [HW4-2.0]  315.98,251 0 top
J22  4P-2.0  [HW4-2.0]  311.4,259.89 90 top
J23  4P-2.0  [HW4-2.0]  326.9,251 0 top
J24  4P-2.0  [HW4-2.0]  337.06,252.78 270 top
J25  4P-2.0-90D  [HW4-2.0-90D]  8.64,9.7 270 bottom
J26  4P-2.0  [HW4-2.0]  344.17,252.78 270 top
J27  4P-2.0  [HW4-2.0]  216.92,224.33 180 top
JP1  PINHD-2X8  [2X08]  39.62,90.22 270 top
JP2  PINHD-2X8  [2X08]  91.19,126.29 0 top
JP3  PINHD-2X4  [2X04]  281.94,100.89 90 top
JP4  PINHD-2X4  [2X04]  362.97,101.14 90 top
JP5  PINHD-2X4  [2X04]  399.54,162.86 90 top
JP6  PINHD-2X10  [2X10]  347.98,100.89 90 top
JP7  PINHD-2X10  [2X10]  429.01,101.14 90 top
JP8  PINHD-2X10  [2X10]  465.58,162.86 90 top
JP9  [2X15]  323.82,79.25 0 top
JP10  [2X15]  404.83,79.53 0 top
JP11  [2X15]  441.38,141.25 0 top
JP12  PINHD-1X2  [1X02]  260.1,146.35 0 top
JP13  PINHD-1X2  [1X02]  260.1,134.92 0 top
JP14  PINHD-1X2  [1X02]  286.51,143.31 0 top
JP15  PINHD-2X8  [2X08]  382.52,132.13 0 top
JP16  PINHD-2X8  [2X08]  192.28,193.6 0 top
JP17  PINHD-1X2  [1X02]  260.1,87.93 0 top
JP18  PINHD-1X2  [1X02]  260.1,123.49 0 top
JP40  [1X04]  6.1,32.31 0 top
LED1  RED  [CHIP-LED0603]  90.17,178.36 270 top
LED2  GREEN  [CHIP-LED0603]  102.11,183.44 90 top
LED3  RED  [CHIP-LED0603]  208.79,137.21 270 top
LED4  RED  [CHIP-LED0603]  157.23,212.65 90 top
OPT1_A  PINHD-1X1  [1X01']  74.42,124.26 0 top
OPT1_B  PINHD-1X1  [1X01']  79.25,140 0 top
OPT2_A  PINHD-1X1  [1X01']  74.42,126.8 0 top
OPT2_B  PINHD-1X1  [1X01']  69.09,138.99 0 top
OPT3_A  PINHD-1X1  [1X01']  79.76,130.1 0 top
OPT3_B  PINHD-1X1  [1X01']  90.93,140.51 0 top
OPT4_A  PINHD-1X1  [1X01']  82.3,130.1 0 top
OPT4_B  PINHD-1X1  [1X01']  79.25,137.46 0 top
OPT5_A  PINHD-1X1  [1X01']  89.92,130.61 0 top
OPT5_B  PINHD-1X1  [1X01']  101.6,138.73 0 top
OPT6_A  PINHD-1X1  [1X01']  92.46,130.61 0 top
OPT6_B  PINHD-1X1  [1X01']  93.22,139.24 0 top
OPT7_A  PINHD-1X1  [1X01']  106.93,125.02 0 top
OPT7_B  PINHD-1X1  [1X01']  112.52,138.99 0 top
OPT8_A  PINHD-1X1  [1X01']  109.47,125.02 0 top
OPT8_B  PINHD-1X1  [1X01']  104.39,141.78 0 top
OPT9_A  PINHD-1X1  [1X01']  114.05,125.02 0 top
OPT9_B  PINHD-1X1  [1X01']  124.97,143.81 0 top
OPT10_A  PINHD-1X1  [1X01']  116.59,125.02 0 top
OPT10_B  PINHD-1X1  [1X01']  117.09,145.59 0 top
OPT11_A  PINHD-1X1  [1X01']  122.17,125.02 0 top
OPT11_B  PINHD-1X1  [1X01']  136.14,148.64 0 top
OPT12_A  PINHD-1X1  [1X01']  124.97,125.02 0 top
OPT12_B  PINHD-1X1  [1X01']  128.02,148.89 0 top
P5_2  [1X01]  186.69,129.34 180 top
P5_3  [1X01]  184.15,129.34 180 top
PA0  PINHD-1X1  [1X01']  79.25,142.54 0 top
PA1  PINHD-1X1  [1X01']  69.34,144.58 0 top
PA2  PINHD-1X1  [1X01']  90.93,143.05 0 top
PA3  PINHD-1X1  [1X01']  79.25,145.08 0 top
PA4  PINHD-1X1  [1X01']  101.35,144.32 0 top
PA5  PINHD-1X1  [1X01']  93.22,145.34 0 top
PA6  PINHD-1X1  [1X01']  112.52,144.58 0 top
PA7  PINHD-1X1  [1X01']  102.87,147.88 0 top
PB0  PINHD-1X1  [1X01']  124.46,152.96 0 top
PB1  PINHD-1X1  [1X01']  126.75,151.43 0 top
PC4  PINHD-1X1  [1X01']  124.46,149.66 0 top
PC5  PINHD-1X1  [1X01']  117.09,147.62 0 top
PGO1  [1X01]  6.35,16.05 0 top
Q1  25MHz  [NX3225]  91.44,164.9 180 top
R1  10k  [RESC1608X60]  50.04,171.5 180 bottom
R2  100R  [RESC1608X60]  46.48,164.64 0 bottom
R3  10k  [RESC1608X60]  50.04,163.12 180 bottom
R4  47R  [R0603]  92.46,157.53 180 top
R5  10k  [R0402]  100.84,181.15 90 top
R6  100R  [RESC1608X60]  46.48,155.75 0 bottom
R7  10k  [RESC1608X60]  50.04,154.74 180 bottom
R8  100R  [RESC1608X60]  46.48,147.37 0 bottom
R9  1k  [R0603]  297.43,133.15 180 top
R10  1k  [R0603]  297.43,136.45 180 top
R11  1k  [R0603]  297.43,140.77 180 top
R12  10k  [RESC1608X60]  50.04,146.1 180 bottom
R13  1k  [R0603]  285.24,133.65 90 top
R14  0R_DNP  [R0603]  321.56,129.59 270 top
R15  0R_DNP  [R0603]  324.36,129.59 270 top
R16  100R  [RESC1608X60]  46.48,137.97 0 bottom
R17  10k  [RESC1608X60]  50.29,137.21 180 bottom
R18  100R  [RESC1608X60]  46.23,129.34 0 bottom
R19  10k  [RESC1608X60]  50.04,128.57 180 bottom
R20  100R  [RESC1608X60]  45.97,120.7 0 bottom
R21  10k  [RESC1608X60]  50.04,119.94 180 bottom
R22  100R  [RESC1608X60]  45.97,112.06 0 bottom
R23  10k  [RESC1608X60]  49.78,76 180 bottom
R24  100R  [RESC1608X60]  43.94,70.41 0 bottom
R25  10k  [RESC1608X60]  49.78,111.05 180 bottom
R26  100R  [RESC1608X60]  46.48,102.92 0 bottom
R27  10k  [RESC1608X60]  49.78,102.41 180 bottom
R28  100R  [RESC1608X60]  46.48,94.28 0 bottom
R29  10k  [RESC1608X60]  50.04,93.52 180 bottom
R30  100R  [RESC1608X60]  47.5,86.41 0 bottom
R31  10k  [RESC1608X60]  49.78,84.63 180 bottom
R32  100R  [RESC1608X60]  46.48,76.76 0 bottom
R33  20k  [R0603]  72.64,130.86 180 top
R34  20k  [R0603]  71.37,136.19 90 top
R35  820R  [R0603]  73.66,132.89 180 top
R36  820R  [R0603]  76.45,134.67 90 top
R37  0R  [R0603]  76.96,141.53 270 top
R38  20k  [R0603]  74.68,146.61 270 top
R39  20k  [R0603]  75.18,150.67 0 top
R40  820R  [R0603]  76.96,146.61 270 top
R41  820R  [R0603]  71.37,149.15 0 top
R42  0R  [R0603]  69.6,141.78 270 top
R43  100k  [R0603]  70.87,161.09 90 top
R44  100k  [R0603]  70.87,157.53 90 top
R45  20k  [R0603]  81.53,133.65 0 top
R46  20k  [R0603]  86.87,131.88 180 top
R47  820R  [R0603]  81.79,136.45 90 top
R48  820R  [R0603]  87.63,136.7 270 top
R49  0R  [R0603]  88.65,141.53 270 top
R50  20k  [R0603]  82.8,148.89 0 top
R51  20k  [R0603]  86.87,149.91 180 top
R52  820R  [R0603]  87.38,146.86 270 top
R53  820R  [R0603]  89.92,146.1 270 top
R54  0R  [R0603]  81.53,141.53 270 top
R55  20k  [R0603]  94.23,136.45 90 top
R56  20k  [R0603]  99.06,136.19 90 top
R57  820R  [R0603]  91.95,136.45 90 top
R58  820R  [R0603]  95.76,131.88 0 top
R59  0R  [R0603]  100.84,141.53 270 top
R60  20k  [R0603]  100.33,131.88 0 top
R61  20k  [R0603]  99.06,147.12 270 top
R62  33R  [R0201]  93.22,175.82 0 top
R63  820R  [R0603]  96.77,150.16 0 top
R64  820R  [R0603]  94.23,147.88 90 top
R65  0R  [R0603]  93.47,142.29 270 top
R66  20k  [R0603]  107.44,132.13 0 top
R67  20k  [R0603]  106.68,135.18 90 top
R68  820R  [R0603]  112.27,134.67 180 top
R69  820R  [R0603]  112.01,136.7 0 top
R70  0R  [R0603]  111.76,141.78 270 top
R71  20k  [R0603]  113.54,132.64 0 top
R72  20k  [R0603]  109.98,147.37 270 top
R73  820R  [R0603]  112.27,147.37 270 top
R74  820R  [R0603]  106.43,147.12 90 top
R75  0R  [R0603]  104.14,144.58 270 top
R76  20k  [R0603]  117.09,129.59 0 top
R77  20k  [R0603]  122.94,132.64 180 top
R78  820R  [R0603]  117.6,136.45 90 top
R79  560R  [R0603]  102.87,180.64 90 top
R80  820R  [R0603]  117.6,133.15 90 top
R81  33R  [R0201]  93.22,173.79 0 top
R82  0R  [R0603]  89.66,174.55 180 top
R83  33R  [R0201]  93.22,174.8 0 top
R84  33R  [R0201]  93.22,172.77 0 top
R85  0R  [R0603]  124.97,146.61 270 top
R86  0R_DNP  [R0603]  89.66,172.52 180 top
R87  0R_DNP  [R0603]  89.66,176.58 180 top
R88  20k  [R0603]  122.17,129.84 0 top
R89  20k  [R0603]  122.68,147.12 270 top
R90  820R  [R0603]  116.59,140.77 0 top
R91  820R  [R0603]  114.81,144.58 270 top
R92  0R  [R0603]  119.13,146.86 270 top
R93  20k  [R0603]  127.76,133.91 0 top
R94  20k  [R0603]  130.81,136.45 90 top
R95  820R  [R0603]  130.81,132.64 90 top
R96  820R  [R0603]  133.86,131.62 0 top
R97  0R  [R0603]  136.14,151.43 270 top
R98  20k  [R0603]  131.83,128.57 0 top
R99  20k  [R0603]  127.25,141.27 270 top
R100  820R  [R0603]  134.62,147.37 270 top
R101  820R  [R0603]  130.81,147.37 90 top
R102  0R  [R0603]  129.54,152.96 0 top
R103  0R  [R0603]  80.52,167.69 270 top
R104  560R  [R0603]  86.11,178.36 0 top
R105  33R  [R0402]  105.92,182.93 90 top
R106  33R  [R0402]  107.19,182.93 90 top
R107  33R  [R0402]  109.73,182.17 270 top
R108  0R_DNP  [R0603]  90.93,170.48 180 top
R109  33R  [R0402]  108.46,182.17 90 top
R110  0R  [R0603]  319.28,129.59 270 top
R111  0R  [R0603]  326.64,129.59 270 top
R112  0R  [R0603]  325.63,127.05 180 top
R113  10k  [R0603]  215.14,117.14 270 top
R114  10k  [R0603]  218.95,120.45 270 top
R115  10k  [R0603]  199.64,117.14 0 top
R116  0R  [R0603]  180.59,124.76 180 top
R117  33R  [R0201]  199.9,137.21 0 top
R118  33R  [R0201]  199.9,136.19 0 top
R119  33R  [R0201]  197.1,132.13 0 top
R120  10k  [R0603]  199.9,114.86 180 top
R121  33R  [R0201]  197.1,131.11 0 top
R122  33R  [R0201]  197.1,130.45 0 top
R123  560R  [R0603]  205.99,137.21 0 top
R124  33R  [R0201]  197.23,129.21 0 top
R125  1k  [R0603]  327.91,263.96 180 top
R126  4.7k  [R0603]  9.4,17.32 0 top
R127  4.7k  [R0603]  9.4,14.53 180 top
R128  5.1k  [R0603]  12.95,33.32 0 top
R129  5.1k  [R0603]  2.03,27.74 0 top
R130  0R  [R0603]  130.3,217.73 90 top
R131  4.7k  [R0603]  10.41,11.99 270 top
R132  0R_DNP  [R0603]  3.56,16.05 180 top
R133  0R  [R0603]  318.01,268.53 0 top
R134  1k  [R0603]  323.34,264.21 0 top
R138  560R  [R0603]  160.78,212.39 180 top
S1  MOMENTARY-SWITCH-SPST-PTH-6.0MM  [TACTILE_SWITCH_PTH_6.0MM]  127.53,276.58 0 bottom
S2  MOMENTARY-SWITCH-SPST-PTH-6.0MM  [TACTILE_SWITCH_PTH_6.0MM]  111.35,284.56 0 bottom
S3  MOMENTARY-SWITCH-SPST-PTH-6.0MM  [TACTILE_SWITCH_PTH_6.0MM]  92.91,289.59 0 bottom
S4  MOMENTARY-SWITCH-SPST-PTH-6.0MM  [TACTILE_SWITCH_PTH_6.0MM]  72.62,288.65 0 bottom
S5  MOMENTARY-SWITCH-SPST-PTH-6.0MM  [TACTILE_SWITCH_PTH_6.0MM]  178.03,299.26 0 bottom
S6  MOMENTARY-SWITCH-SPST-PTH-6.0MM  [TACTILE_SWITCH_PTH_6.0MM]  178.31,285.95 0 bottom
S7  MOMENTARY-SWITCH-SPST-PTH-6.0MM  [TACTILE_SWITCH_PTH_6.0MM]  173.08,292.53 0 bottom
S8  MOMENTARY-SWITCH-SPST-PTH-6.0MM  [TACTILE_SWITCH_PTH_6.0MM]  183.21,292.58 0 bottom
S9  MOMENTARY-SWITCH-SPST-PTH-6.0MM  [TACTILE_SWITCH_PTH_6.0MM]  190.09,310.57 0 bottom
S10  MOMENTARY-SWITCH-SPST-PTH-6.0MM  [TACTILE_SWITCH_PTH_6.0MM]  153.59,278.74 0 bottom
S11  MOMENTARY-SWITCH-SPST-PTH-6.0MM  [TACTILE_SWITCH_PTH_6.0MM]  149.63,289.89 0 bottom
U1  CY8C5868AXI-LP035  [TQFP-100-14X14MM]  207.01,127.3 270 top
U2  CY8C5868AXI-LP035  [TQFP-100-14X14MM]  172.21,214.17 0 top
U3  [QRE1113]  48.26,168.2 90 bottom
U4  [QRE1113]  48.26,159.56 90 bottom
U5  [QRE1113]  48.26,150.93 90 bottom
U6  [QRE1113]  48.26,142.04 90 bottom
U7  [QRE1113]  48.26,133.4 90 bottom
U8  [QRE1113]  48.26,124.51 90 bottom
U9  [QRE1113]  48.26,115.87 90 bottom
U10  [QRE1113]  48.26,106.98 90 bottom
U11  [QRE1113]  48.26,98.35 90 bottom
U12  [QRE1113]  48.26,89.71 90 bottom
U13  [QRE1113]  48.01,80.82 90 bottom
U14  [QRE1113]  48.01,72.19 90 bottom
U15  R-78E5.0-1.0  [DC-DC_CONVERTER_78XX]  116.08,195.38 180 top
U16  TEXAS_TPS2051B  [TEXAS_SOT23-5]  43.69,80.06 0 bottom
U17  R-78E5.0-1.0  [DC-DC_CONVERTER_78XX]  362.97,135.43 90 top
U18  R-78E5.0-1.0  [DC-DC_CONVERTER_78XX]  352.04,135.18 90 top
U19  TCA9548APWR  [SOP65P640X120-24N]  204.98,210.62 180 top
U20  TCA9548APWR  [SOP65P640X120-24N]  327.91,258.88 0 top
U22  AS5600  [SOIC8-1.27-5X4MM]  4.57,9.96 0 top
U$1  RK09  [RK09]  115.06,309.17 0 bottom
U$2  RK09  [RK09]  77.98,309.68 0 bottom
U$3  CMR0512S3C  [CMR0512S3C]  328.93,140 0 top
U$5  SS-7188VS-A-FLS  [SS-7188VS-A-FLS_RJ45]  328.42,306.37 180 bottom
U$6  SS-7188VS-A-FLS  [SS-7188VS-A-FLS_RJ45]  328.42,274.12 180 bottom
U$9  P82B96DP,118  [SO8]  342.14,298.5 90 top
U$10  P82B96DP,118  [SO8]  342.39,260.91 270 top
VREGGND  PINHD-1X1  [1X01']  324.1,132.38 90 top
VREGIN  PINHD-1X1  [1X01']  321.56,132.38 90 top
X1  3221-10-0300-00  [3221-10-0300-00]  149.35,218.24 270 top
X2  3221-10-0300-00  [3221-10-0300-00]  131.32,173.79 180 top
X3  3221-10-0300-00  [3221-10-0300-00]  157.99,134.67 180 top
X6  2520-  [PAK100/2500-20]  241.81,125.78 270 top
X7  2520-  [PAK100/2500-20]  227.08,125.78 270 top

## Tracks (layer width: path | path; a pad name or v marks a point on that pad's centre or on a via)
3V3  (via drill 0.35)
  Top 0.305: C99.1 IC7.4 97.28,141.02 v96.38,141.92 | C101.1 108.2,137.35 IC8.4 v108.2,140.51 | C103.1 IC9.4 v120.9,140.51 | C105.1 IC10.4 v132.59,140.26 | C41.1 IC1.4 85.09,139.88 84.97,140 v84.97,140.26 | C45.1 IC17.4 v73.41,140
  Top 0.61: R43.2 71.07,161.74 | C43.1 73.01,161.17 IC4.5 72.71,161.53 72.39,161.85 72.28,161.74
  Top 0.813: 72.28,161.74 72.28,162.1 70.87,162.1 | 70.87,162.1 R43.2 | C31.1 69.23,161.74 69.6,162.1 70.87,162.1
  Top 1.27: IC4.5 72.71,161.38 72.14,161.95 72.14,162.61 v71.63,163.12
  Route15 0.305: 132.21,139.88 v132.59,140.26 | 108.2,140 v108.2,140.51 | 85.09,139.5 84.97,139.62 v84.97,140.26
  Route15 0.508: 100.84,141.27 98.25,141.27 98.15,141.18 97.13,141.18 v96.38,141.92
  Route15 1.27: v71.63,163.12 68.83,160.32 68.83,146.86 67.56,145.59 67.56,143.31 70.39,140.48 70.39,140.25 71.11,139.52 71.35,139.52 71.88,138.99 71.88,138.73 72.39,138.73 73.66,140 75.21,138.45 75.21,136.95 76.73,135.43 81.03,135.43 85.09,139.5 | 85.09,139.5 85.09,140.26 | 85.09,139.5 88.9,139.5 92.71,135.69 92.71,133.65 97.54,128.83 JP2.14 | 100.84,141.27 101.36,141.27 102.63,140 108.2,140 111.51,136.7 115.32,136.7 119.13,140.51 v120.9,140.51 120.93,140.48 120.93,140.25 122.2,138.99 131.32,138.99 132.21,139.88
  pour Route15 (isolate 0.813): 65.28,168.2 82.04,168.2 82.04,161.09 102.62,161.09 106.43,157.28 106.43,153.72 109.98,150.16 118.87,150.16 123.19,154.48 136.65,154.48 138.94,152.2 138.94,121.72 65.79,121.72 65.28,122.22
3V3A
  Top 0.254: C65.1 94.46,159.31 94.83,159.67 IC3.33 | 76.45,166.9 C116.1 | C116.1 76.2,166.68 76.2,166.42
  Top 0.305: 76.33,166.55 76.45,166.67 76.45,166.9
  Top 0.406: IC11.1 76.91,166.55 76.33,166.55 76.2,166.42 76.09,166.53 C113.1
  Top 0.61: R4.1 93.31,159.28 C65.1 93.34,157.14 91.95,155.75 91.44,155.75
  Top 0.813: C113.1 75.44,165.91
  Top 1.016: C110.1 73.57,165.91 75.44,165.91 76.2,165.91 | 91.44,155.75 89.66,155.75 87.38,158.04 87.12,158.04
  Top 1.27: C110.1 72.9,165.57 72.9,165.4 71.24,165.4 C111.1 68.17,165.53 C112.+ | 77.47,164.13 3V3A.1
  Top 1.905: 3V3A.1 76.2,165.91
  Top 2.54: 77.47,164.13 77.47,162.36 78.49,161.34 81.03,161.34 81.17,161.2 D3.A 84.84,160.32 87.12,158.04
3V3A2  (via drill 0.65)
  Top 0.254: C124.1 209.41,117.02 209.03,117.4 | U1.65 208.02,119.3 208.02,118.41 209.03,117.4 | 209.03,117.4 v210.82,117.4
  Top 1.016: C124.1 210.82,115.23 210.82,114.37 C125.1 | IC18.2 185.04,117.65 187.06,117.65 C152.1 187.82,118.14 C153.1 194.33,118.14 195.58,116.89 3V3A_2.1
  Top 1.27: 180.09,117.65 185.04,117.65 | 189.23,119.43 189.23,118.39 C153.1
  Top 2.54: IC18.PAD 178.71,118.77 178.56,118.92 181.61,118.92 181.61,114.35 175.51,114.35 175.51,117.4 177.29,119.18 178.05,119.18 178.05,116.13 177.8,115.87 180.09,115.87 180.09,117.65 | 188.98,119.43 189.23,119.43
  pour Route15 (no thermals): 173.99,112.57 174.24,112.83 174.24,118.16 181.86,125.78 200.41,125.78 202.69,123.49 223.52,123.49 223.52,137.97 230.12,137.97 230.12,112.57
3V3A4  (5 unrouted)
  Top 0.254: U2.65 181.11,215.18 181.12,215.19 C136.1 182.12,215.3 182.12,216.46 183.13,217.47 C137.1
3V3D2  (via drill 0.65)
  Top 0.254: U1.75 214.64,119.3 C133.1 214.63,119.68 v213.87,120.45 | U1.88 216.57,127.3 C154.1 217.03,128.18 217.7,128.85 v217.7,129.11 | C150.1 215.01,134.91 U1.100 214.91,133.4 213.36,133.4 v213.11,133.15 | U1.26 199.01,133.67 C148.1 | C151.1 197.61,128.32 198.11,127.81 U1.37 200.67,127.8 v200.91,127.56 | C149.1 198.74,121.04 U1.50 198.91,121.21 196.85,121.21 196.8,121.25 v195.07,121.25
  Top 0.813: v162.56,136.45 160.62,136.45 X3.1 | C148.1 198.72,134.67 198.77,134.81 198.91,134.67 v199.9,134.67
  Top 1.016: IC20.PAD 169.82,115.52 3V3D2.1 | IC20.2 165.84,123.84 C157.1 165.5,124 165.35,124.14 165.35,126.26 C161.1
  Top 1.27: C161.1 164.59,125.5 164.59,124.76 163.58,124.76 v163.58,124.51
  Top 2.54: IC20.PAD 163.68,115.52 161.29,117.91 161.29,118.67 150.11,118.67 152.4,116.38 152.65,116.13 | 163.07,116.38 171.96,116.38 171.96,114.1 171.72,113.85 151.14,113.85 153.03,115.75 152.65,116.13 | 152.65,116.13 161.8,116.13
  Route15 0.254: v195.07,121.25 195.07,127.05 195.33,127.3
  Route15 0.813: v213.87,120.45 213.87,124.76 213.61,125.02
  Route15 1.27: v163.58,124.51 164.59,124.51 166.62,122.48
  pour Route15 (no thermals): 140.97,139.24 222.76,139.24 222.76,124.51 202.95,124.51 200.66,126.8 181.61,126.8 173.23,118.41 173.23,113.33 172.72,112.83 141.99,112.83 140.97,113.84
3V3D3  (via drill 0.55)  (1 unrouted)
  Top 0.305: R125.1 329.28,263.96 U20.24 332.33,262.45
  Top 0.406: R134.2 v325.37,264.21
  Top 0.813: C162.1 332.51,262.27 C164.1 | C164.1 330.82,263.96 v330.71,263.96 | 332.33,262.45 332.74,262.45 C164.1
  Top 1.016: 338.48,266.97 IC15.PAD | J22.3 313.67,260.89 314.45,261.67 314.17,261.95 C168.1 | C167.1 344.95,266.61 IC15.2
  Top 1.27: IC15.2 338.51,266.78 IC15.PAD | 338.44,267.51 340.11,267.51 340.87,266.75 v341.88,266.75
  pour Route15 (isolate 0.508): 307.85,282.5 347.47,282.5 347.47,245.92 307.85,245.92
3V3D5  (17 unrouted)
  Top 0.254: U2.88 172.2,222.18 172.2,223.07 171.96,223.31 C142.1 | U2.75 180.59,220.55 C144.1 | U2.50 179.34,206.17 C141.1 | U2.37 171.71,204.64 C146.1 | U2.26 166.08,206.04 C145.1 | U2.100 165.09,222.17 C143.1
5VD2
  Top 1.016: IC20.3 162.97,121.82 159.51,125.27 5VD2.1 157.76,125.5 C160.1 150.49,125.5 C156.1 150.24,125.51 J16.2 J16.1
  Top 1.27: IC20.3 163.55,119.71 164.34,118.92 171.96,118.92 175.01,121.97 183.01,121.97 IC18.3
5VD4  (6 unrouted)
+1.8V  (via drill 0.35)
  Top 0.254: C73.2 C100.1 97.48,147.97 R61.1 | v128.5,141.87 127.51,141.87 R99.1
  Top 0.305: C26.2 75.04,130.86 74.42,130.86 | 73,151.77 74.09,150.67 R39.1 | C35.2 88.53,132.69 R46.1 | R51.1 87.86,150.05 C39.2 88.71,151 88.57,151 v88.39,151.18 | 109.55,134.85 109.02,134.33 v107.95,134.33 R67.1 | 109.55,134.85 C77.2 | C101.2 109.4,134.85 109.55,134.85 | R72.1 109.53,147.77 C102.1 108.2,149.04 C81.2 v107.75,150.42 | C103.2 121.41,135.54 C85.2 123.79,135.2 123.79,134.05 | 123.79,134.05 R77.1 | C93.2 132.59,134.53 C105.2 132.19,135.8 131.83,135.43 130.98,135.43 R94.1 131.15,135.6 v132.08,134.67 | 73.23,147.57 73.15,147.65 C46.1 73.15,147.5 73.27,147.62 | 73.15,147.4 73.27,147.28 73.27,147.62 | 73.27,147.62 v73.27,148.29 | v73.45,151.91 73.31,151.77 73,151.77 | C29.2 72.96,151.77 73,151.77 | C42.1 85.34,147.62 84.92,148.05 v84.82,148.05 | C73.2 v96.01,148.89 | C62.2 v98.04,133.91 | C104.1 121.36,147.97 R89.1 121.83,147.97 v121.41,148.39 | 123.79,134.05 v123.64,133.91 | C106.1 132.33,147.77 v132.33,148.39 | C97.2 129.03,142.4 v128.5,141.87 | C89.2 115.2,148.27 v115.82,148.89
  Top 0.406: R56.1 98.86,135.54 97.54,135.54 C99.2 97.28,134.27 C62.2 | C45.2 73.41,134.42 v73.15,134.42 | IC4.4 74.61,158.55 IC4.3 | C35.2 88.53,134.56 v88.65,134.67 | C41.2 85.99,136.05 v86.11,135.94
  Top 0.61: IC4.3 74.75,158.11 75.33,158.11 C44.1 | C43.2 74.61,162.06 IC4.4 | C44.1 75.33,158.55 74.61,158.55 | C44.1 75.44,156.26 75.44,159.31 | R33.1 74.42,130.86 v74.42,129.84
  Top 1.27: 75.44,159.31 v75.69,159.31
  Route2 0.406: v73.15,134.42 73.15,134.16
  Route2 1.27: v75.69,159.31 75.69,150.93
  pour Route2 (isolate 0.813): 65.79,121.21 138.68,121.21 138.68,152.45 87.12,152.96 86.36,152.96 78.49,160.83 74.17,160.83 65.79,152.45
+3V3  (via drill 0.35, 0.65)
  Top 0.254: IC3.52 105.43,155.16 105.41,155.14 C8.1 105.81,154.34 | IC3.62 110.43,154.62 C6.1 111.14,153.9 C13.1 | IC3.72 115.57,156.11 115.57,155.75 | C67.1 119.13,163.68 | 119.13,163.68 IC3.84 | 119.13,163.68 119.43,163.68 119.89,164.13 120.54,164.13 C12.1 | IC3.95 117.85,169.18 117.86,169.17 118.26,169.17 118.29,169.21 C66.1 119.38,169.21 119.78,169.61 C11.1 | IC3.108 117.37,175.69 118.74,175.69 C7.1 119.78,176.47 C63.1 | IC3.121 109.43,178.7 109.48,178.74 C68.1 109.48,179.77 109.84,180.14 C20.1 | IC3.131 C69.1 104.44,179.14 104.44,179.44 104.76,179.76 C55.1 | C4.1 97.79,177.75 IC3.144 IC3.143 | IC3.17 95.09,167.68 95.08,167.69 C9.1 94.09,167.55 C2.1 | C14.1 99.57,153.83 99.57,154.23 99.46,154.23 C10.1 98.94,154.78 98.94,155.2 98.93,155.22 IC3.39 98.93,157.16 99.06,157.28 99.06,161.34 v98.04,162.36 98.04,162.1 97.48,161.54 97.39,161.54 97.02,161.18 IC3.30 | C1.1 105.81,154.34 | 105.81,154.34 107.08,154.34 v107.7,153.72 | IC3.6 97.69,173.18 v98.04,173.53
  Top 0.305: IC11.4 78.63,169.58 77.98,170.23 75.18,170.23 74.17,171.25 74.17,173.81
  Top 0.406: 115.57,155.75 115.68,155.75 C3.1
  Top 0.508: C2.1 94.09,166.67 94.49,166.67 v94.23,166.42
  Top 0.61: 111.14,153.9 112.08,153.9 112.27,153.72 v112.52,153.72 | 115.57,155.75 v117.09,155.75 | 119.89,164.13 119.63,164.39 v119.63,164.64 | 119.78,169.61 119.63,169.75 v119.63,170.74 | C63.1 119.49,176.47 v119.13,176.83 | v111.25,181.66 111.25,181.55 110.6,180.9 C20.1 | C55.1 104.39,180.76 v104.39,181.41 | IC3.144 97.43,178.1 v96.77,178.1
  Top 0.813: X2.1 v133.86,177.85
  Top 1.016: IC12.2 77.63,174.38 C107.1 81.24,174.38 C108.1 83.97,174.68 C109.+ 85.6,174.78 | 85.6,174.78 86.64,174.78 3V3D.1 | R104.1 85.26,175.12 85.6,174.78
  Top 1.27: D3.C 88.03,168.6 v88.14,168.71
  Top 1.905: IC12.2 74.17,173.81 70.79,173.81 IC12.PAD
  other vias: 73.91,173.79
  pour Route15 (isolate 0.813): 65.02,186.23 65.02,168.96 82.8,168.96 82.8,161.85 102.87,161.85 107.19,157.53 107.19,154.23 110.49,150.93 118.62,150.93 122.94,155.24 136.91,155.24 138.94,157.28 138.94,186.74 138.43,186.23
+5V
  Top 0.406: IC11.6 77.03,169.21 76.96,169.21
  Top 0.508: 76.96,169.21 76.71,169.47 74.68,169.47
  Top 0.61: 74.68,169.47 74.42,169.72 72.9,169.72
  Top 0.813: 72.9,169.72 72.14,170.48
  Top 1.016: IC12.3 77.47,176.5 77.47,177.85 5V.1 79.88,180.64 C114.1 82.7,180.51 C115.+
  Top 1.27: 72.14,170.48 68.83,170.48 67.82,171.5 67.82,176.58 69.09,177.85 | 77.22,177.85 77.47,178.1 | J17.1 J17.2 91.68,181.41 | 91.68,181.41 91.69,181.41 | 91.68,181.41 91.44,181.41 90.19,180.16 83.06,180.16
  Top 2.54: 69.09,177.85 77.22,177.85 | 77.47,178.1 5V.1 | 77.47,177.85 79.25,179.63 82.02,179.63 C115.+ 83.06,180.16
+5V/1  (via drill 0.35, 0.9)
  Top 0.254: C117.1 366.41,138.88 C119.1
  Top 0.406: 366.41,138.88 366.07,138.53 363.53,138.53
  Top 0.61: U17.VOUT 363.53,138.53
  Top 0.813: R14.2 321.56,128.32 320.29,127.05 v318.26,127.05
  Top 2.54: v417.07,131.62 412.75,135.94 412.75,140 v412.59,140.17
  Route15 0.813: v318.26,127.05 321.31,124 340.11,124 346.96,130.86 346.46,131.37 346.46,132.38 345.69,133.15 5V/1.1
  Route15 1.27: JP7.19 430.28,113.08 428.5,114.86 416.31,114.86 414.53,113.08 411.23,113.08 409.7,114.6 409.7,118.67 417.07,126.03 v417.07,131.62
  pour Route15: 364.49,140.77 353.82,140.77 329.95,116.89 329.95,102.41 331.47,100.89 429.77,100.89 433.83,104.95 433.83,133.4 435.86,135.43 466.85,135.43 470.15,138.73 470.15,188.77 468.38,190.55 425.7,190.55 407.67,172.52 407.67,154.99 393.19,140.51 364.74,140.51
+9V
  Top 0.203: C58.1 289.84,136.68 289.84,136.38 290.17,136.05 | 289.31,136.45 289.76,136.45 289.76,136.35
  Top 0.254: 290.17,136.05 290.32,135.9 | C47.1 307.99,143.06 C51.1
  Top 0.406: C56.1 288.4,137.35 289.31,136.45 | 289.76,136.35 290.06,136.05 290.17,136.05
  Top 0.508: 290.32,135.9 290.32,133.4 289.97,133.04 288.51,133.04 IC2.7
  Top 0.61: IC5.OUT 310.02,142.66 C47.1
  Top 0.813: 288.54,139.24 288.54,137.86 C56.1
  Top 1.27: C47.1 291.96,142.66 288.54,139.24
+12V  (1 unrouted)
  Top 0.203: C120.1 366.09,132.9 366.09,132.64
  Top 0.254: C120.1 365.74,132.64
  Top 0.406: C118.1 367.14,132.64 366.27,132.64 | 366.27,132.64 366.09,132.64 | 366.27,132.64 366.09,132.82 365.51,132.82
  Top 0.813: 365.74,132.64 363.22,132.64 U17.VIN
  Top 1.27: U17.VIN 362.71,132.64 U18.VIN
  Route2 1.27: JP15.1 365,130.86 U17.VIN
-9V  (via drill 0.35)
  Top 0.254: C59.2 293.24,135.56 IC2.4 | 313.32,135.18 C52.2
  Top 0.406: C57.2 293.51,135.83 293.24,135.56
  Top 0.61: IC6.OUT 313.32,136.84 313.32,135.18 C48.2
  Top 0.813: IC2.4 293.68,136.51 v295.15,137.97
  Bottom 1.27: v295.15,137.97 306.83,137.97 309.88,134.92 313.18,134.92 313.94,135.69 IC6.OUT
AGND  (via drill 0.3, 0.35)
  Top 0.254: C64.2 92.54,160.55 | 92.03,160.55 C65.2 | IC3.31 97.46,160.68 | 97.66,160.88 97.71,160.83 | C106.2 IC10.11 | C116.2 76.2,167.69
  Top 0.305: C100.2 IC7.11 97.28,143.31 v97.03,143.05 | C102.2 IC8.11 108.2,142.8 107.95,142.54 v107.95,142.8 | C104.2 IC9.11 v120.9,142.54 | C46.2 73.41,145.45 IC17.11 v73.41,142.49 | v132.49,143.31 132.59,143.41 IC10.11 | IC1.11 85.09,145.59 85.34,145.59 C42.2 85.24,145.6 v84.23,145.6 | C113.2 75.58,167.69 76.2,167.69 76.46,167.94 77.72,167.94 IC11.PAD 78.74,167.94 79.84,166.84 R103.2
  Top 0.406: IC11.5 IC11.PAD | 76.45,167.69 76.58,167.69 76.58,168.2
  Top 0.61: 97.46,160.68 97.66,160.88 | 97.71,160.83 v98.04,160.83 | IC4.2 73.66,156.63 C44.2 73.41,156.88 73.41,156.68 R44.1 | C32.2 68.21,157.13 68.07,157.28 67.82,157.28
  Top 0.813: v90.68,159.82 91.42,160.55 92.03,160.55 92.54,160.55 | C32.2 68.98,157.13 69.34,156.77 70.78,156.77 R44.1 | C110.2 73.46,167.83 C113.2 76.31,167.83 76.45,167.69 | 77.72,167.94 76.84,167.94 v76.53,168.25 76.58,168.2
  Top 1.016: 67.82,157.28 v67.56,157.28 | R103.2 80.52,164.64 AGND.1
  Top 1.27: C44.2 73.77,156.01 v72.64,156.01 | C110.2 72.99,168.2 71.25,168.2 C111.2 68.17,168.33 C112.-
  Route2 0.254: 90.93,159.82 v90.68,159.82
  Route2 1.27: v98.04,160.83 97.03,159.82 90.93,159.82
  Route15 0.305: 132.59,143.31 v132.49,143.31 | 120.65,143.05 120.9,142.8 v120.9,142.54 | v97.03,143.05 96.52,143.05 96.14,143.43 | 84.23,145.34 v84.23,145.6 | 73.41,142.54 v73.41,142.49
  Route15 1.27: v72.64,156.01 70.87,154.23 70.87,148.39 73.41,145.85 73.41,142.54 74.68,143.81 76.96,143.81 76.96,146.1 79.5,148.64 82.3,148.64 84.84,146.1 85.34,146.1 86.11,145.34 | 84.23,145.34 86.11,145.34 | 86.11,145.34 87.38,145.34 88.14,146.1 89.66,146.1 90.93,147.37 95.76,147.37 97.28,145.85 97.28,144.58 | 97.28,144.58 97.28,143.81 100.08,146.61 100.08,148.13 103.89,151.94 110.24,151.94 111,151.18 111,148.13 107.95,145.08 v107.95,142.8 108.49,143.33 108.49,143.57 111.53,146.61 114.3,146.61 115.47,145.44 115.47,144.92 116.57,143.81 121.41,143.81 | 120.65,143.05 121.41,143.81 | 121.41,143.81 123.19,145.59 130.3,145.59 132.59,143.31 | JP2.15 JP2.13 100.58,125.02 102.11,126.54 102.11,128.57 100.33,130.35 100.33,133.91 97.54,136.7 95,136.7 94.74,136.96 94.74,138.47 94.84,138.57 94.84,139.92 94.74,140.02 94.74,142.04 96.14,143.43 97.28,144.58
  pour Route2 (isolate 0.813): 65.02,169.72 65.02,154.23 73.15,162.36 79.25,162.36 87.12,154.48 105.16,154.48 106.68,156.01 106.68,159.31 103.89,162.1 84.84,162.1 79.25,167.69 79.25,167.94 78.74,168.45 69.34,168.45 68.33,169.47 68.33,169.72
AGND2  (via drill 0.35, 0.65, 2.03)  (1 unrouted)
  Top 0.254: U1.64 207.51,116.79 C124.2 207.66,116.13 207.49,116.13 207.25,116.37 | C125.2 207.66,114.49 | 206.23,116.37 v206.26,116.37 206.74,116.37
  Top 0.61: C163.2 193.32,122.73 v192.02,122.73 | JP12.2 263.91,146.35 | JP13.2 263.91,134.92 v266.06,132.77 | v266.06,122.1 264.67,123.49 JP18.2 | v266.06,86.54 264.67,87.93 263.91,87.93 | 263.91,87.93 JP17.2 | v266.06,92.13 263.91,89.97 263.91,87.93 | 266.06,100.63 266.06,101.73 266.45,101.73
  Top 1.016: IC18.1 186.83,115.39 C152.2 187.82,115.14 C153.2 192.05,115.14 AGND_2.1 | 207.66,114.49 207.66,116.13 | 207.25,116.37 206.74,116.37 | 206.23,116.37 205.72,115.85 C126.2
  Top 1.27: R116.1 182.37,124.76 182.88,124.26 v182.88,124
  Top 2.54: v266.06,137.85 v266.06,141.02 | 266.45,141.53 266.06,141.15 v266.06,141.02 | v266.06,141.02 266.04,141.05 v266.06,144.2 v266.07,144.19 267.56,144.17 267.72,144.32 | v266.06,137.85 267.59,137.85 267.97,137.46 | v266.06,141.02 266.19,141.02 | v266.06,141.02 266.19,141.15 268.48,141.15 | v266.06,80.19 266.06,100.63 | 266.06,103.17 v266.06,137.85 | v266.06,83.36 268.48,83.36 268.61,83.24 266.19,83.24 | v266.06,95.3 266.32,95.55 268.61,95.55 | v266.06,106.98 266.19,107.11 266.32,107.11 | 266.32,107.11 268.48,107.11 | 266.32,107.11 266.19,106.98 | 268.22,118.92 v266.06,118.92 266.19,118.92 | 268.61,129.59 v266.06,129.59 266.32,129.59
  Route2 2.54: 266.04,76.86 v266.06,144.2 266.04,148.84
  other vias: 266.06,126.42 266.06,115.75 266.06,110.16 266.06,103.81 266.06,98.48
  pour Route2 (no thermals): 173.23,111.81 174.24,112.83 174.24,118.16 181.86,125.78 200.41,125.78 202.44,123.75 223.52,123.75 223.52,139.24 231.14,139.24 231.14,111.81
  pour Top: 262.38,148.39 270,148.39 270,77.01 262.38,77.01
  pour Route2: 238.51,142.54 244.86,142.54 244.86,174.29 274.07,174.29 274.07,67.61 244.86,67.61 244.86,109.52 237.24,109.52 237.24,142.54
AGND4  (9 unrouted)
AGND5  (via drill 0.35)
  Top 0.203: C58.2 290.32,137.1 | C59.1 291.6,137.1
  Top 0.254: 332.18,141.88 332.18,141.78 | 332.18,141.78 331.47,141.78 C54.1 | C53.2 332.18,141.78 | 309.35,143.96 308.95,143.56 C51.2 308.36,143.81 308.36,143.96 | C52.1 312.02,135.58
  Top 0.305: 290.32,137.1 C56.2 | 291.6,137.1 C57.1
  Top 0.406: 332.34,142.54 332.49,142.4 332.49,142.19 332.18,141.88
  Top 0.508: IC2.3 291.97,134.29 v291.85,134.42
  Top 0.61: IC6.GND 311.4,136.7 312.02,136.08 312.02,135.58 C48.1 | C47.2 308.36,143.96 309.35,143.96 310.37,143.96 310.4,143.99 311.86,143.99 IC5.GND | U$3.P$4 331.47,141.78 331.47,142.54 | 331.47,142.54 331.1,142.54 C49.1 | 331.47,142.54 332.34,142.54 C50.2
  Top 0.813: C57.1 C56.2 v290.83,137.72 290.97,137.72
  Route2 1.016: JP4.6 JP4.5 JP4.3 | JP4.4 JP4.6 | JP4.6 360.17,102.41 359.16,104.7 359.16,106.48 361.7,108.76 361.7,116.13 352.3,125.53 319.53,125.53
  Route2 1.27: U$3.P$4 331.47,134.67 325.88,129.08 319.53,129.08 319.53,125.53